# Altium project mojo_signal_conversion_circuit_1.PrjPcb
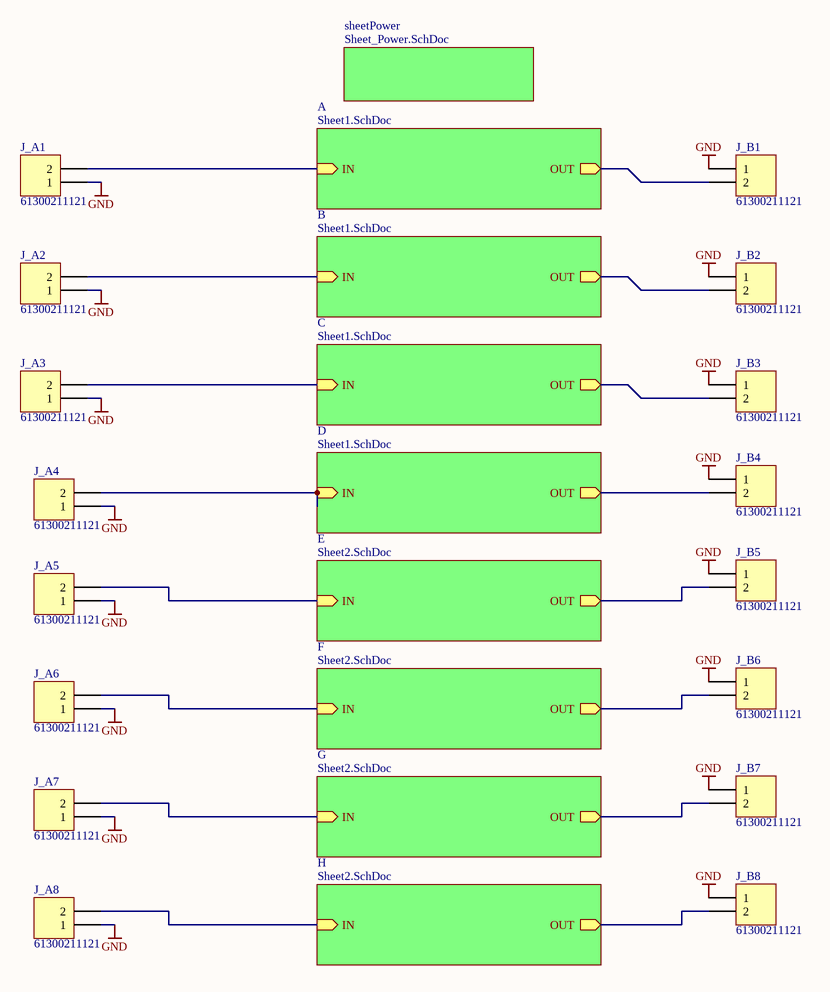
[diagram p0: sheet_top.SchDoc]
4 sheets, 141 parts. Net scope: hierarchical (ports join the sheet entries above them; power ports are global).
Board file: board.PcbDoc
Sheets:
  sheet_top.SchDoc
    sheetPower = Sheet_Power.SchDoc
    A = Sheet1.SchDoc
    B = Sheet1.SchDoc
    C = Sheet1.SchDoc
    D = Sheet1.SchDoc
    E = Sheet2.SchDoc
    F = Sheet2.SchDoc
    G = Sheet2.SchDoc
    H = Sheet2.SchDoc

## Sheet sheet_top.SchDoc
size A4

### Parts
J_A1  61300211121  [61300211121]
J_A2  61300211121  [61300211121]
J_A3  61300211121  [61300211121]
J_A4  61300211121  [61300211121]
J_A5  61300211121  [61300211121]
J_A6  61300211121  [61300211121]
J_A7  61300211121  [61300211121]
J_A8  61300211121  [61300211121]
J_B1  61300211121  [61300211121]
J_B2  61300211121  [61300211121]
J_B3  61300211121  [61300211121]
J_B4  61300211121  [61300211121]
J_B5  61300211121  [61300211121]
J_B6  61300211121  [61300211121]
J_B7  61300211121  [61300211121]
J_B8  61300211121  [61300211121]

### Sub-sheets
A = Sheet1.SchDoc: OUT (out), IN (in)
B = Sheet1.SchDoc: OUT (out), IN (in)
C = Sheet1.SchDoc: OUT (out), IN (in)
D = Sheet1.SchDoc: OUT (out), IN (in)
E = Sheet2.SchDoc: OUT (out), IN (in)
F = Sheet2.SchDoc: OUT (out), IN (in)
G = Sheet2.SchDoc: OUT (out), IN (in)
H = Sheet2.SchDoc: OUT (out), IN (in)
sheetPower = Sheet_Power.SchDoc: no entries

### Nets
GND: J_A1.1 J_A2.1 J_A3.1 J_A4.1 J_A5.1 J_A6.1 J_A7.1 J_A8.1 J_B1.1 J_B2.1 J_B3.1 J_B4.1 J_B5.1 J_B6.1 J_B7.1 J_B8.1
NetJ11_A_2: J_B1.2 ; sheet A/OUT
NetJ11_B_2: J_B2.2 ; sheet B/OUT
NetJ11_C_2: J_B3.2 ; sheet C/OUT
NetJ11_D_2: J_B4.2 ; sheet D/OUT
NetJ_A1_2: J_A1.2 ; sheet A/IN
NetJ_A2_2: J_A2.2 ; sheet B/IN
NetJ_A3_2: J_A3.2 ; sheet C/IN
NetJ_A4_2: J_A4.2 ; sheet D/IN
NetJ_A5_2: J_A5.2 ; sheet E/IN
NetJ_A6_2: J_A6.2 ; sheet F/IN
NetJ_A7_2: J_A7.2 ; sheet G/IN
NetJ_A8_2: J_A8.2 ; sheet H/IN
NetJ_B5_2: J_B5.2 ; sheet E/OUT
NetJ_B6_2: J_B6.2 ; sheet F/OUT
NetJ_B7_2: J_B7.2 ; sheet G/OUT
NetJ_B8_2: J_B8.2 ; sheet H/OUT

### Notes on the sheet
- Title
- Size:
- Modified:
- A4
- Project:
- Time:
- Sheet
- of
- Created:
- Author:
- Prj. #:
- Alfons Riedinger
- File:
- Revision:

### Library data of the parts
J_A1-J_A8 J_B1-J_B8 = CMP-001-0071-1: 2Pol; gerade; WR-PHD 2.54 mm THT Pin Header; Brand: Wurth Electronics; Current Rating: 3 A; Insulation Resistance: 1 GOhms; Latching Type: Unlatched; Mating Post Length: 6 mm; Mounting Angle: Straight; Number of Positions: 2 Position; Pitch: 2.54 mm; Voltage Rating: 250 V; Accessory Type: -; Application: Wire to Board; ComponentLink1Description: 6130xx11121-538006.pdf; ComponentLink1URL: http://www.mouser.com/ds/2/445/6130xx11121-538006.pdf; Contact Gender: Pin (Male); Contact Material: Copper Alloy; Contact Plating: Gold; Contact Type: -; Flammability Rating: UL 94 V-0; Housing Gender: -; Housing Material: Polybutylene Terephthalate (PBT); Manufacturer: Wurth Electronics; Manufacturer Part Number: 61300211121; Minimum Order Quantity: 1; Mounting Style: Straight Pin; Number of Rows: 1 Row; Packaging: Bulk; Product: Headers; Reeling: False; RoHS - Mouser: Y; Row Spacing: -; Series: WR-PHD; Standard Pack Qty: 1000; Supplier: Mouser; Supplier Part Number: 710-61300211121; Termination Post Length: 3 mm; Termination Style: Through Hole; Type: Pin Strip; PartNumber: 61300211121

## Sheet Sheet_Power.SchDoc
size A4
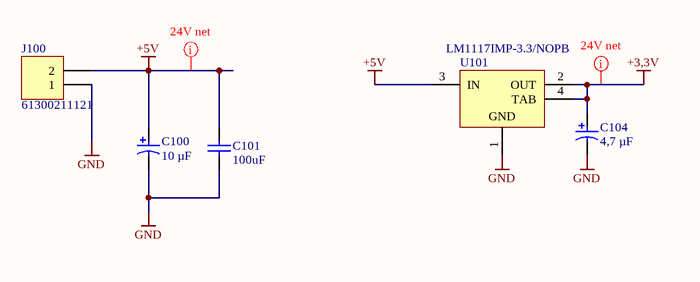
[diagram p1: Sheet_Power.SchDoc]

### Parts
C100  10 µF  [KEMT-520-D_Low]
C101  100uF  [CAPC1206(3216)190_L]
C104  4,7 µF  [A Package]
J100  61300211121  [61300211121]
U101  LM1117IMP-3.3/NOPB  [DCY0004A_N]

### Nets
+3,3V: C104.1 U101.2(OUT) U101.4(TAB)
+5V: C100.1 C101.2 J100.2 U101.3(IN)
GND: C100.2 C101.1 C104.2 J100.1 U101.1(GND)

### Layout directives
net class 24V_net: +3,3V, +5V

### Library data of the parts
C100 = CMP-001-0033-3: 10 µF, 35V, 125 mOhm, Gr. D / partnumb: T495D106K035ATE125; Manufacturer: KEMET; Capacitance: 10µF; Lifetime @ Temp.: 2000 Hrs @ 85°C; Tolerance: ±10%; Type: Molded; ComponentLink1Description: docfinder?Partnumber=T495D106K035ATE300; ComponentLink1URL: http://www.kemet.com/docfinder?Partnumber=T495D106K035ATE300; ESR (Equivalent Series Resistance): 125 mOhm; Failure Rate: -; Features: General Purpose; Height - Seated (Max): 0.122" (3.10mm); Lead Spacing: -; Manufacturer Size Code: D; Mounting Type: Surface Mount; Operating Temperature: -55°C ~ 125°C; Package / Case: 2917 (7343 Metric); Packaging: Cut Tape (CT); Part Status: Active; Size / Dimension: 0.287" L x 0.169" W (7.30mm x 4.30mm); Supplier: Digi-Key; Supplier Part Number: 399-10292-1-ND; Voltage - Rated: 35V; PartNumber: T495D106K035ATE125
C101 = CMP-00469-2: CAP 100uF 6.3V ±20% 1206 (3216 Metric) Thickness 1.9mm SMD; PartNumber: 885012108005; Manufacturer: WURTH ELEKTRONIK; Tolerance: Â±20%; Case-EIA: 1206; Case-Metric: 3216; Technology: SMT; Max Thickness: 1.9 mm; Rated Voltage: 6.3 V; Value: 100uF; Supplier: Farnell; Supplier Part Number: 2495155; ComponentLink1Description: 2326302.pdf; ComponentLink1URL: http://www.farnell.com/cad/2326302.pdf; ComponentLink2Description: 1958456.pdf; ComponentLink2URL: http://www.farnell.com/datasheets/1958456.pdf; Manufacturer Part Number: 885012108005
C104 = CMP-001-0039-3: 4,7 µF; 6V; Gr. A; T491A475K006AT; Manufacturer: KEMET; Capacitance: 4.7µF; ESR (Equivalent Series Resistance): 6 Ohm; Lifetime @ Temp.: 2000 Hrs @ 85°C; Tolerance: ±10%; Type: Molded; Voltage - Rated: 6.3V; ComponentLink1Description: KEM_T2005_T491.pdf; ComponentLink1URL: http://www.kemet.com/Lists/ProductCatalog/Attachments/254/KEM_T2005_T491.pdf; Failure Rate: -; Features: General Purpose; Height - Seated (Max): 0.071" (1.80mm); Lead Spacing: -; Manufacturer Size Code: A; Mounting Type: Surface Mount; Operating Temperature: -55°C ~ 125°C; Package / Case: 1206 (3216 Metric); Packaging: Cut Tape (CT); Part Status: Active; Size / Dimension: 0.126" L x 0.063" W (3.20mm x 1.60mm); Supplier: Digi-Key; Supplier Part Number: 399-9717-1-ND; PartNumber: T491A475K006AT
J100 = CMP-001-0071-1: as J_A1 on sheet sheet_top; Accessory Type: -; Application: Wire to Board; ComponentLink1Description: 6130xx11121-538006.pdf; ComponentLink1URL: http://www.mouser.com/ds/2/445/6130xx11121-538006.pdf; Contact Gender: Pin (Male); Contact Material: Copper Alloy; Contact Plating: Gold; Contact Type: -; Flammability Rating: UL 94 V-0; Housing Gender: -; Housing Material: Polybutylene Terephthalate (PBT); Manufacturer: Wurth Electronics; Manufacturer Part Number: 61300211121; Minimum Order Quantity: 1; Mounting Style: Straight Pin; Number of Rows: 1 Row; Packaging: Bulk; Product: Headers; Reeling: False; RoHS - Mouser: Y; Row Spacing: -; Series: WR-PHD; Standard Pack Qty: 1000; Supplier: Mouser; Supplier Part Number: 710-61300211121; Termination Post Length: 3 mm; Termination Style: Through Hole; Type: Pin Strip; PartNumber: 61300211121
U101 = CMP-00484-1: 800mA Low-Dropout Linear Regulator, 4-pin SOT-223, Pb-Free; Manufacturer: Texas Instruments; PackageTopMarking: XYTT*N05B; PowerWise: N; High-Reliability: Y; CompType: LDO IC; Code_IPC: SOT223-4; PackageReference: DCY0004A; PinCount: 4; PackageDescription: Molded SOT-223, 6.50 x 3.56 x 1.6mm Body, 4 Lead, 2.3mm Pitch; PartNumber: LM1117IMP-3.3/NOPB; RoHS: Y; ComponentLink1Description: Datasheet URL; Code_JEDEC: TO-261-AA; ComponentLink1URL: http://www.ti.com/general/docs/lit/getliterature.tsp?genericPartNumber=LM1117-N&fileType=pdf

## Sheet Sheet1.SchDoc
size A4; Author: Christian Kieser; Engineer: Christian Kieser
Used 4 times, as channels A, B, C, D. Parts and nets are listed once, with the designators drawn on the sheet.
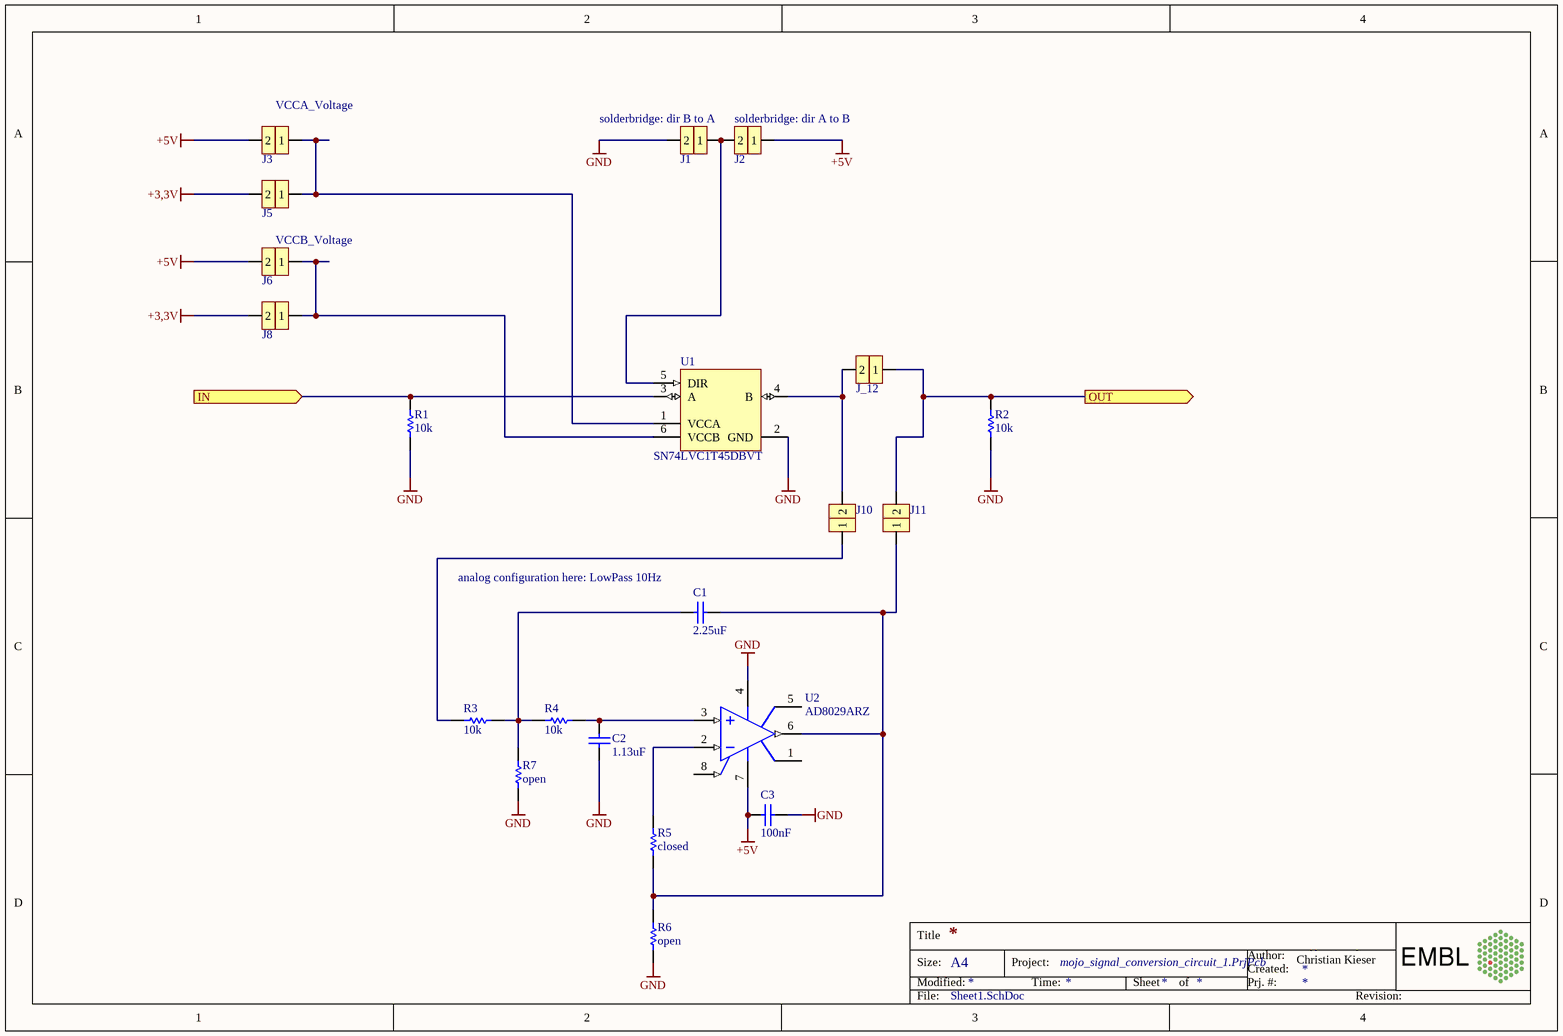
[diagram p2: Sheet1.SchDoc]

### Parts
C1  2.25uF  [CAPC1206(3216)190_N]
C2  1.13uF  [CAPC1206(3216)190_N]
C3  100nF  [CAPC2013X88X50ML20T25]
J1  normal solderbridge  [PCBComponent]  (value not drawn)
J2  normal solderbridge  [PCBComponent]  (value not drawn)
J3  normal solderbridge  [PCBComponent]  (value not drawn)
J5  normal solderbridge  [PCBComponent]  (value not drawn)
J6  normal solderbridge  [PCBComponent]  (value not drawn)
J8  normal solderbridge  [PCBComponent]  (value not drawn)
J10  normal solderbridge  [PCBComponent]  (value not drawn)
J11  normal solderbridge  [PCBComponent]  (value not drawn)
J_12  normal solderbridge  [PCBComponent]  (value not drawn)
R1  10k  [YAGO-RC0805_M]
R2  10k  [YAGO-RC0805_M]
R3  10k  [YAGO-RC0805_M]
R4  10k  [YAGO-RC0805_M]
R5  closed  [YAGO-RC0805_M]
R6  open  [YAGO-RC0805_M]
R7  open  [YAGO-RC0805_M]
U1  SN74LVC1T45DBVT  [DBV0006A_M]
U2  AD8029ARZ  [ADI-R-8_L]

### Ports
IN (in), OUT (out)

### Nets
+3,3V: J5.2 J8.2
+5V: C3.2 J2.1 J3.2 J6.2 U2.7(+VS)
GND: C2.1 C3.1 J1.2 R1.1 R2.1 R6.2 R7.2 U1.2(GND) U2.4(-VS)
IN: R1.2 U1.3(A) ; port IN
OUT: J11.2 J_12.1 R2.2 ; port OUT
NetC1_1: C1.1 R3.1 R4.2 R7.1
NetC1_2: C1.2 J11.1 R5.2 R6.1 U2.6(VOUT)
NetC2_2: C2.2 R4.1 U2.3(+IN)
NetJ1_1: J1.1 J2.2 U1.5(DIR)
NetJ3_1: J3.1 J5.1 U1.1(VCCA)
NetJ6_1: J6.1 J8.1 U1.6(VCCB)
NetJ10_1: J10.1 R3.2
NetJ10_2: J10.2 J_12.2 U1.4(B)
NetR5_1: R5.1 U2.2(-IN)

Not connected (* = marked no-connect by the designer): U2 1(NC) 5(NC) 8(~{DISABLE})

### Channels
A: designators end in _A; ports IN=NetJ_A1_2 OUT=NetJ11_A_2
B: designators end in _B; ports IN=NetJ_A2_2 OUT=NetJ11_B_2
C: designators end in _C; ports IN=NetJ_A3_2 OUT=NetJ11_C_2
D: designators end in _D; ports IN=NetJ_A4_2 OUT=NetJ11_D_2

### Notes on the sheet
- (near J3) VCCA_Voltage
- solderbridge: dir B to A
- (near J2) solderbridge: dir A to B
- (near J6) VCCB_Voltage
- (near C1) analog configuration here: LowPass 10Hz
- Christian Kieser
- Title
- Size:
- Modified:
- A4
- Project:
- Time:
- Sheet
- of
- Created:
- Author:
- Prj. #:
- Alfons Riedinger
- File:
- Revision:

### Library data of the parts
C1 C2 = CMP-001-0138-A.1: CAP CER 1UF 10V X7R 1206; Manufacturer: Wurth Electronics Inc.; Manufacturer Part Number: 885012208013; Notification: Current market demand for these product types have resulted in fluctuating and extending lead times. Lead times may differ.; Tolerance: ±10%; Applications: General Purpose; ComponentLink1Description: 885012208013.pdf; ComponentLink1URL: http://katalog.we-online.de/pbs/datasheet/885012208013.pdf; Features: -; Height - Seated (Max): -; Lead Spacing: -; Lead Style: -; Mounting Type: Surface Mount, MLCC; Operating Temperature: -55°C ~ 125°C; Package / Case: 1206 (3216 Metric); Packaging: Cut Tape (CT); Part Status: Active; Ratings: -; Size / Dimension: 0.126" L x 0.063" W (3.20mm x 1.60mm); Supplier: Digi-Key; Supplier Part Number: 732-7685-1-ND; Temperature Coefficient: X7R; Thickness (Max): 0.051" (1.30mm); Voltage - Rated: 10V
C3 = CMP-001-0082-2: generic 0805 COG oder X7R Vielschichtkondensatoren max. +/-10%
J1-J3 J5 J6 J8 J10 J11 J_12 = CMP-001-0133-A.1
R1-R7 = CMP-001-0027-2: 0805 Yageo Standard BlackBox Resistors; Power (Watts): 0.125W, 1/8W; Temperature Coefficient: ±200ppm/°C; Tolerance: ±1%; ComponentLink1Description: PYu-RC_Group_51_RoHS_L_7.pdf; Part Status: Active; Size / Dimension: 0.079" L x 0.049" W (2.00mm x 1.25mm); Supplier Device Package: 0805; ComponentLink1URL: http://www.yageo.com/documents/recent/PYu-RC_Group_51_RoHS_L_7.pdf; Composition: Thick Film; Failure Rate: -; Features: Moisture Resistant; Height - Seated (Max): 0.024" (0.60mm); Manufacturer: Yageo; Operating Temperature: -55°C ~ 155°C; Package / Case: 0805 (2012 Metric); Packaging: Digi-Reel®
U1 = CMP-00492-1: Single-Bit Dual-Supply Bus Transceiver with Configurable Voltage Translation and 3-State Outputs, DBV0006A, SMALL T&R; Manufacturer: Texas Instruments; 3-State Output: Yes; VCC(Min)(V): 1.65; tpd @ Nom Voltage(Max)(ns): 15.5,8,5.8,4.4; Technology Family: LVC; Logic: True; Bits(#): 1; Rating: Catalog; Sub-Family: Dual Supply Translator; Schmitt Trigger: No; VCC(Max)(V): 5.5; Voltage(Nom)(V): 1.8,2.5,3.3,5; Output Drive (IOL/IOH)(Max)(mA): 32/-32; Input Type: CMOS/TTL; ICC @ Nom Voltage(Max)(mA): 0.004; Output Type: CMOS; F @ Nom Voltage(Max)(Mhz): 150; DatasheetVersion: SCES515K; Operating Temperature Range(C): -40 to 85; Generic Part Number: SN74LVC1T45; PackageReference: DBV0006A
U2 = CMP-00480-1: Single Channel RRIO Operational Amplifier, 125 MHz BW, 62 V/us SR, Industrial, 8-pin SOIC (R-8), Tube; Manufacturer: Analog Devices; Generic Part Number: AD8029; Slew Rate: 62V/us; V Span Min: 2.7V; Input Bias Current: 700nA; Amplifiers Per Package: 1; Iq/Amp: 1.5mA; V Span Max: 12V; Input Offset Voltage: 1.6mV; Small Signal Bandwidth: 125MHz; PackageVersion: 060506-A; ComponentLink3URL: http://www.analog.com/static/imported-files/packages/PKG_PDF/SOIC_Narrow%20(R)/R_8.pdf; ComponentLink1Description: Manufacturer URL; ComponentLink1URL: http://www.analog.com/en/index.html; Code_JEDEC: MS-012-AA; ComponentLink2URL: http://www.analog.com/static/imported-files/data_sheets/AD8029_8030_8040.pdf; ComponentLink3Description: Package Specification; PackageDescription: 8-Pin Standard Small Outline Package, Body 3.9 x 4.9 mm, Pitch 1.27 mm; PartNumber: AD8029ARZ; Mounting Technology: Surface Mount; PackageReference: R-8; DatasheetVersion: Rev. B; ComponentLink2Description: Datasheet

## Sheet Sheet2.SchDoc
size A4
Used 4 times, as channels E, F, G, H. Parts and nets are listed once, with the designators drawn on the sheet.
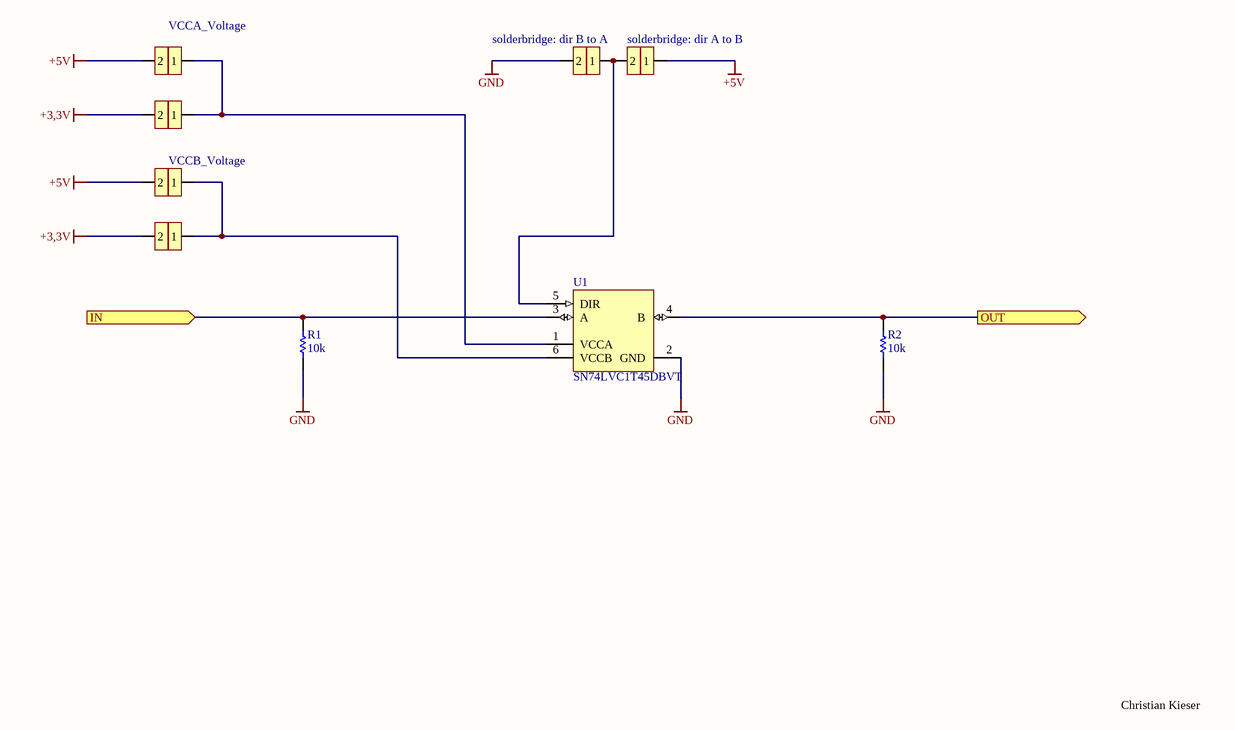
[diagram p3: Sheet2.SchDoc]

### Parts
J1  normal solderbridge  [PCBComponent]  (value not drawn)
J3  normal solderbridge  [PCBComponent]  (value not drawn)
J4  normal solderbridge  [PCBComponent]  (value not drawn)
J6  normal solderbridge  [PCBComponent]  (value not drawn)
J7  normal solderbridge  [PCBComponent]  (value not drawn)
J8  normal solderbridge  [PCBComponent]  (value not drawn)
R1  10k  [YAGO-RC0805_M]
R2  10k  [YAGO-RC0805_M]
U1  SN74LVC1T45DBVT  [DBV0006A_M]

### Ports
IN (in), OUT (out)

### Nets
+3,3V: J3.2 J6.2
+5V: J1.2 J4.2 J8.1
GND: J7.2 R1.1 R2.1 U1.2(GND)
IN: R1.2 U1.3(A) ; port IN
OUT: R2.2 U1.4(B) ; port OUT
NetJ1_1: J1.1 J3.1 U1.1(VCCA)
NetJ4_1: J4.1 J6.1 U1.6(VCCB)
NetJ7_1: J7.1 J8.2 U1.5(DIR)

### Channels
E: designators end in _E; ports IN=NetJ_A5_2 OUT=NetJ_B5_2
F: designators end in _F; ports IN=NetJ_A6_2 OUT=NetJ_B6_2
G: designators end in _G; ports IN=NetJ_A7_2 OUT=NetJ_B7_2
H: designators end in _H; ports IN=NetJ_A8_2 OUT=NetJ_B8_2

### Notes on the sheet
- (near J1) VCCA_Voltage
- solderbridge: dir B to A
- (near J8) solderbridge: dir A to B
- (near J4) VCCB_Voltage
- Christian Kieser
- Title
- Size:
- Modified:
- A4
- Project:
- Time:
- Sheet
- of
- Created:
- Author:
- Prj. #:
- Alfons Riedinger
- File:
- Revision:

### Library data of the parts
J1 J3 J4 J6-J8 = CMP-001-0133-A.1
R1 R2 = CMP-001-0027-2: as R1 on sheet Sheet1; ComponentLink1Description: PYu-RC_Group_51_RoHS_L_7.pdf; Part Status: Active; Size / Dimension: 0.079" L x 0.049" W (2.00mm x 1.25mm); Supplier Device Package: 0805; ComponentLink1URL: http://www.yageo.com/documents/recent/PYu-RC_Group_51_RoHS_L_7.pdf; Composition: Thick Film; Failure Rate: -; Features: Moisture Resistant; Height - Seated (Max): 0.024" (0.60mm); Manufacturer: Yageo; Operating Temperature: -55°C ~ 155°C; Package / Case: 0805 (2012 Metric); Packaging: Digi-Reel®
U1 = CMP-00491-1: Single-Bit Dual-Supply Bus Transceiver with Configurable Voltage Translation and 3-State Outputs, DBV0006A, SMALL T&R; Manufacturer: Texas Instruments; 3-State Output: Yes; VCC(Min)(V): 1.65; tpd @ Nom Voltage(Max)(ns): 15.5,8,5.8,4.4; Technology Family: LVC; Logic: True; Bits(#): 1; Rating: Catalog; Sub-Family: Dual Supply Translator; Schmitt Trigger: No; VCC(Max)(V): 5.5; Voltage(Nom)(V): 1.8,2.5,3.3,5; Output Drive (IOL/IOH)(Max)(mA): 32/-32; Input Type: CMOS/TTL; ICC @ Nom Voltage(Max)(mA): 0.004; Output Type: CMOS; F @ Nom Voltage(Max)(Mhz): 150; DatasheetVersion: SCES515K; Operating Temperature Range(C): -40 to 85; Generic Part Number: SN74LVC1T45; PackageReference: DBV0006A

## Nets that join several sheets
+3,3V: Sheet_Power (C104.1 U101.2 U101.4), A (J5_A.2 J8_A.2), B (J5_B.2 J8_B.2), C (J5_C.2 J8_C.2), D (J5_D.2 J8_D.2), E (J3_E.2 J6_E.2), F (J3_F.2 J6_F.2), G (J3_G.2 J6_G.2), H (J3_H.2 J6_H.2)
+5V: Sheet_Power (C100.1 C101.2 J100.2 U101.3), A (5 pins), B (5 pins), C (5 pins), D (5 pins), E (J1_E.2 J4_E.2 J8_E.1), F (J1_F.2 J4_F.2 J8_F.1), G (J1_G.2 J4_G.2 J8_G.1), H (J1_H.2 J4_H.2 J8_H.1)
GND: sheet_top (16 pins), Sheet_Power (5 pins), A (9 pins), B (9 pins), C (9 pins), D (9 pins), E (J7_E.2 R1_E.1 R2_E.1 U1_E.2), F (J7_F.2 R1_F.1 R2_F.1 U1_F.2), G (J7_G.2 R1_G.1 R2_G.1 U1_G.2), H (J7_H.2 R1_H.1 R2_H.1 U1_H.2)
NetJ11_A_2: sheet_top (J_B1.2), A (J11_A.2 J_12_A.1 R2_A.2)
NetJ11_B_2: sheet_top (J_B2.2), B (J11_B.2 J_12_B.1 R2_B.2)
NetJ11_C_2: sheet_top (J_B3.2), C (J11_C.2 J_12_C.1 R2_C.2)
NetJ11_D_2: sheet_top (J_B4.2), D (J11_D.2 J_12_D.1 R2_D.2)
NetJ_A1_2: sheet_top (J_A1.2), A (R1_A.2 U1_A.3)
NetJ_A2_2: sheet_top (J_A2.2), B (R1_B.2 U1_B.3)
NetJ_A3_2: sheet_top (J_A3.2), C (R1_C.2 U1_C.3)
NetJ_A4_2: sheet_top (J_A4.2), D (R1_D.2 U1_D.3)
NetJ_A5_2: sheet_top (J_A5.2), E (R1_E.2 U1_E.3)
NetJ_A6_2: sheet_top (J_A6.2), F (R1_F.2 U1_F.3)
NetJ_A7_2: sheet_top (J_A7.2), G (R1_G.2 U1_G.3)
NetJ_A8_2: sheet_top (J_A8.2), H (R1_H.2 U1_H.3)
NetJ_B5_2: sheet_top (J_B5.2), E (R2_E.2 U1_E.4)
NetJ_B6_2: sheet_top (J_B6.2), F (R2_F.2 U1_F.4)
NetJ_B7_2: sheet_top (J_B7.2), G (R2_G.2 U1_G.4)
NetJ_B8_2: sheet_top (J_B8.2), H (R2_H.2 U1_H.4)